# EasyEDA schematic easyeda_schematic.json
TITLE: Sheet_1; REV: 1.0; Date: 2023-10-26; Sheet: 1/1; Drawn By: cuu508; Company: Your Company
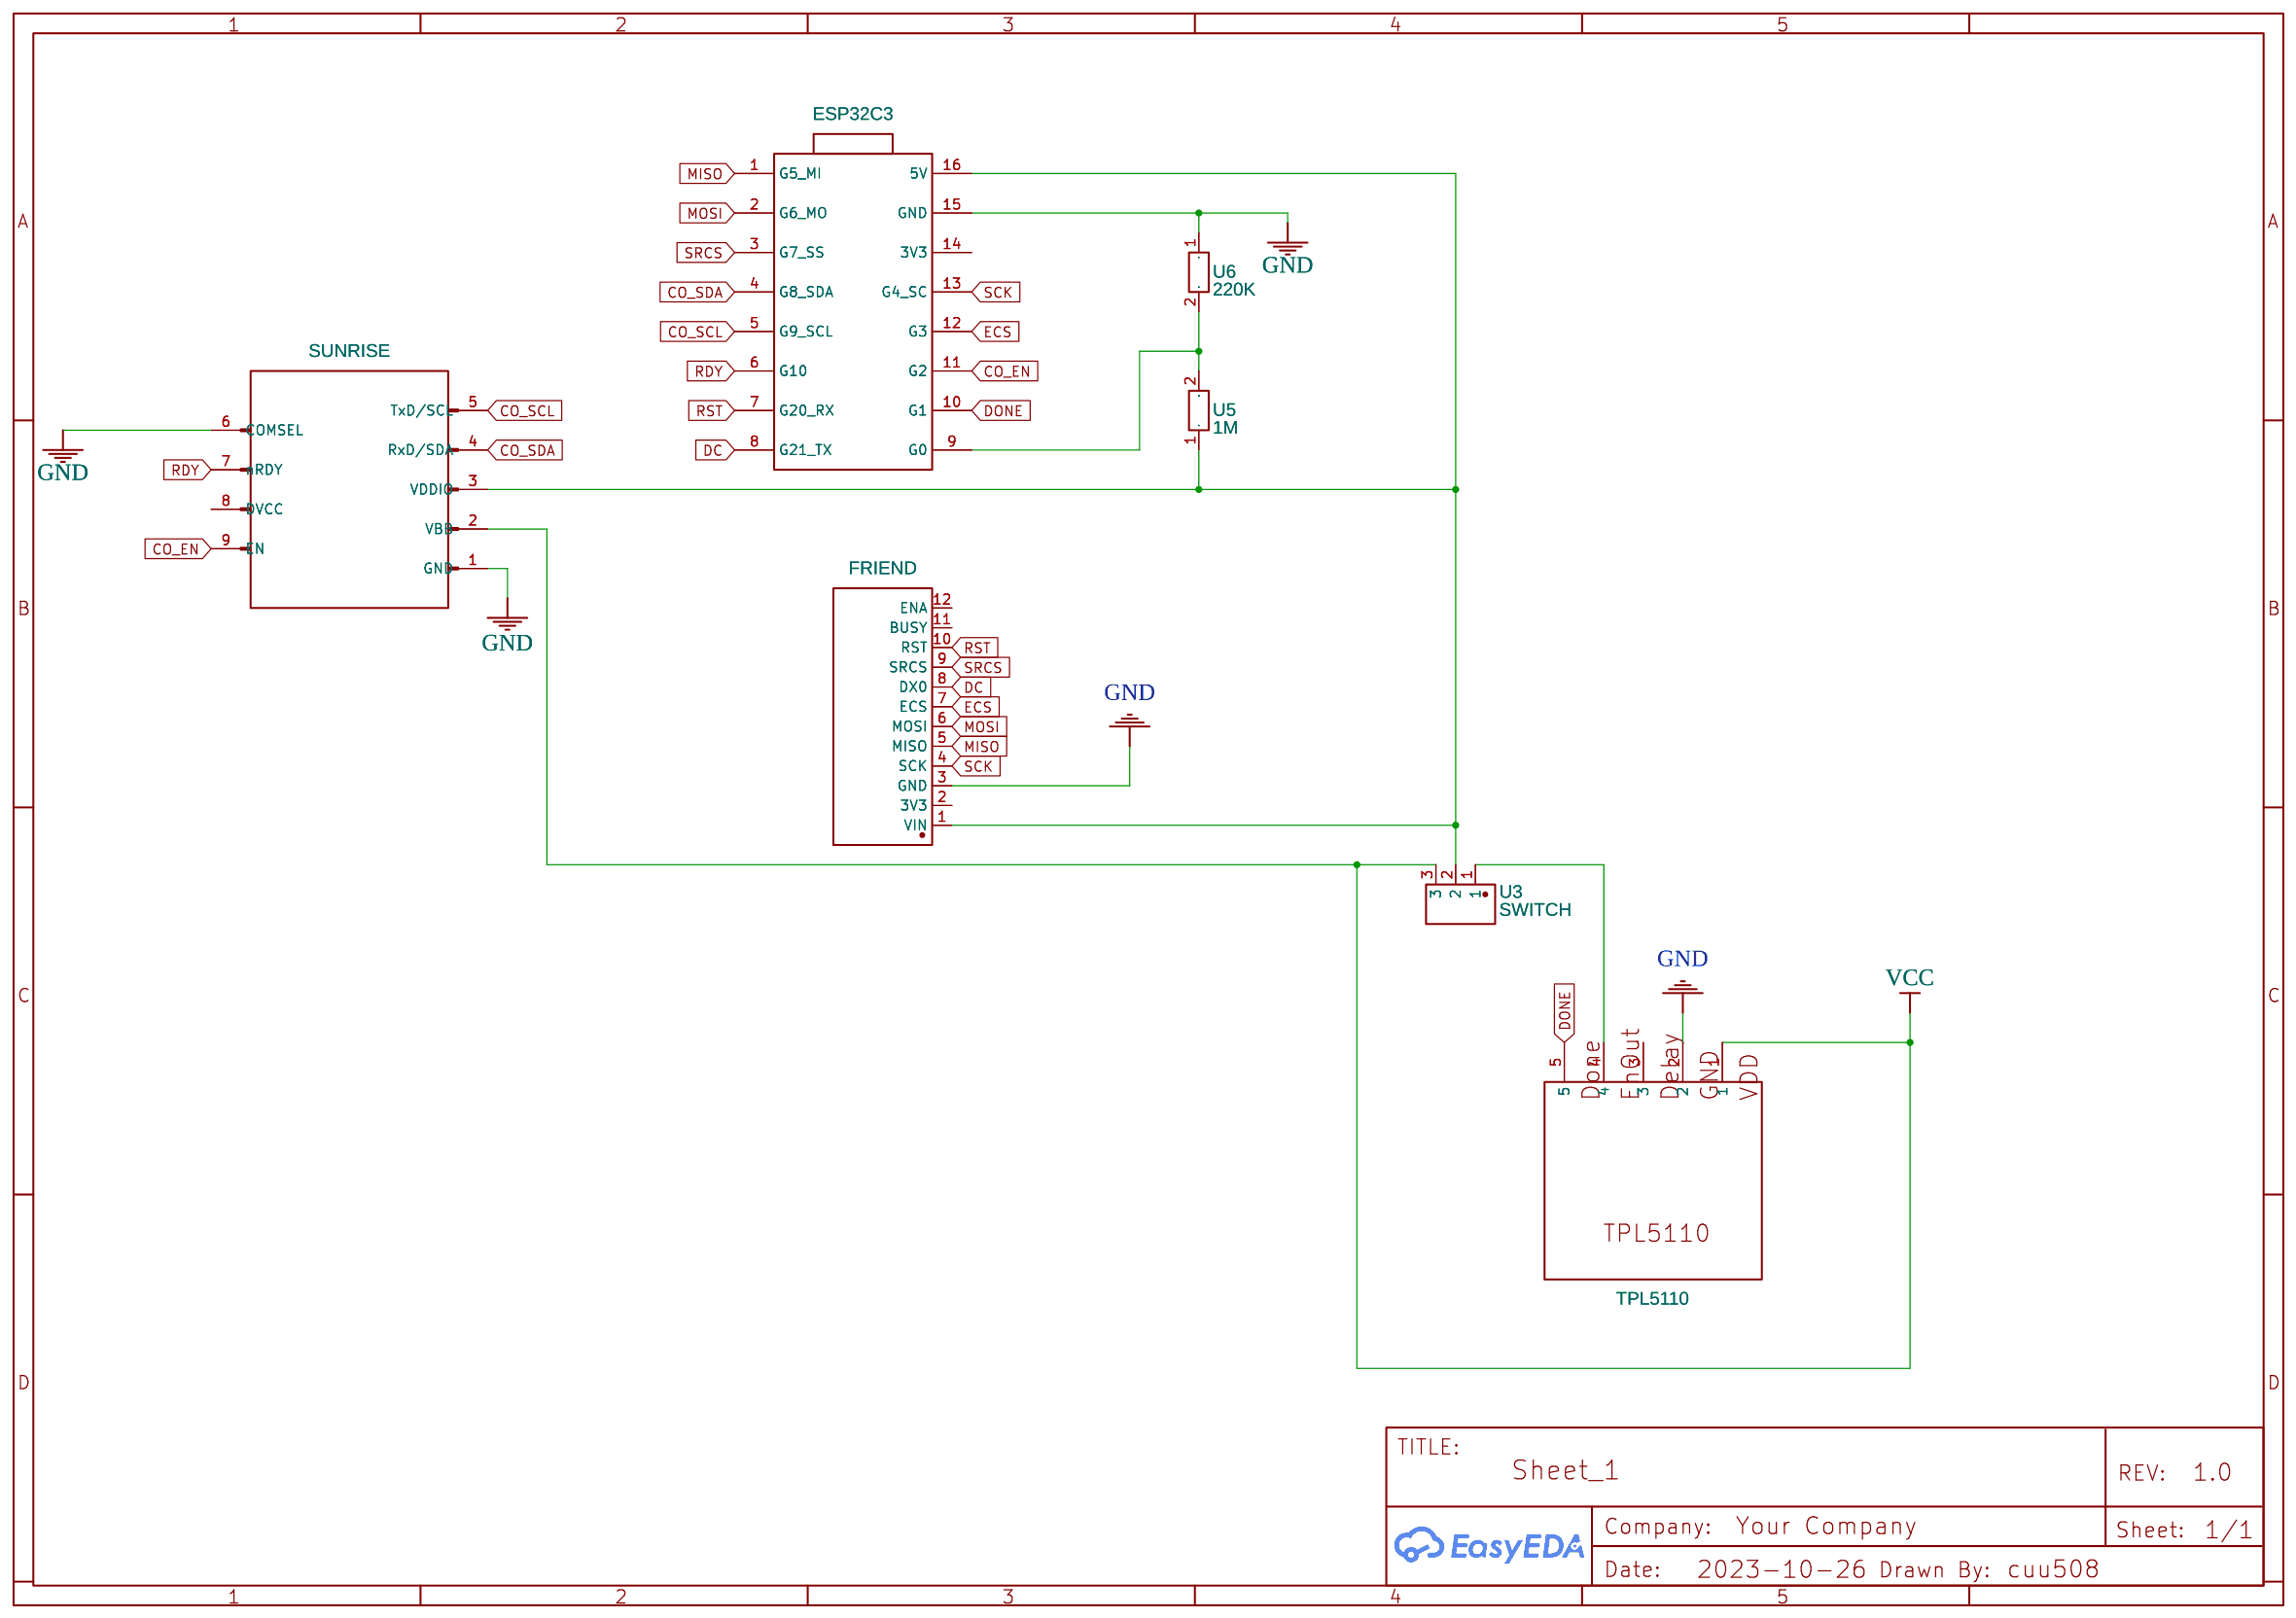
[diagram p0: schematic sheet]

## Parts
ESP32C3  ESP32C3_SUPERMINI  [ESP32-C3 SUPERMINI]
FRIEND  Adafruit eInk Breakout Friend  [ADAFRUIT EINK FRIEND]
SUNRISE  SenseAir_Sunrise  [CM1106SL_SUNRISE]
TPL5110  TPL5110  [ADAFRUIT-TPL5110]
U3  SWITCH  [HDR-TH_3P-P2.54-V-M-A]
U5  1M  [GENERIC THROUGH-HOLE RESISTOR]
U6  220K  [GENERIC THROUGH-HOLE RESISTOR]

## Library data of the parts
ESP32C3 = ESP32C3_SUPERMINI: Contributor: mlnrpt
FRIEND = Adafruit eInk Breakout Friend: Manufacturer: Adafruit; Supplier: Adafruit; Supplier Part: 4224; link: https://www.adafruit.com/product/4224; Contributor: hapax.legomina
SUNRISE = SenseAir_Sunrise: Supplier: Digi-Key; Contributor: newdream
TPL5110 = TPL5110: Contributor: Thierry66
U3 = JUMPER3: Contributor: LCSC; Supplier: LCSC; Supplier Part: C2940050; Manufacturer: null; Manufacturer Part: Jumper3; JLCPCB Part Class: Extended Part; link: https://lcsc.com/eda_search?q=C2940050&%26type=1&ref=editor
U5 U6 = Generic Resistor: Contributor: db_ecd

## Nets
GND: ESP32C3.15(GND) FRIEND.3(GND) SUNRISE.1(GND) SUNRISE.6(COMSEL) TPL5110.2 U6.1
VCC: SUNRISE.2(VBB) TPL5110.1 U3.3
CO_EN: ESP32C3.11(G2) SUNRISE.9(EN)
CO_SCL: ESP32C3.5(G9 SCL) SUNRISE.5(TxD/SCL)
CO_SDA: ESP32C3.4(G8 SDA) SUNRISE.4(RxD/SDA)
DC: ESP32C3.8(G21 TX) FRIEND.8(DX0)
DONE: ESP32C3.10(G1) TPL5110.5
ECS: ESP32C3.12(G3) FRIEND.7(ECS)
MISO: ESP32C3.1(G5 MI) FRIEND.5(MISO)
MOSI: ESP32C3.2(G6 MO) FRIEND.6(MOSI)
RDY: ESP32C3.6(G10) SUNRISE.7(nRDY)
RST: ESP32C3.7(G20 RX) FRIEND.10(RST)
SCK: ESP32C3.13(G4 SC) FRIEND.4(SCK)
SRCS: ESP32C3.3(G7 SS) FRIEND.9(SRCS)
Net-(ESP32C3-9): ESP32C3.9(G0) U5.2 U6.2
Net-(ESP32C3-16): ESP32C3.16(5V) FRIEND.1(VIN) SUNRISE.3(VDDIO) U3.2 U5.1
Net-(TPL5110-4): TPL5110.4 U3.1

Not connected (* = marked no-connect by the designer): ESP32C3 14(3V3); FRIEND 2(3V3) 11(BUSY) 12(ENA); SUNRISE 8(DVCC); TPL5110 3
